# Altium schematic sheet Regulators.SchDoc
size A; SheetNumber: 6; SheetTotal: 6
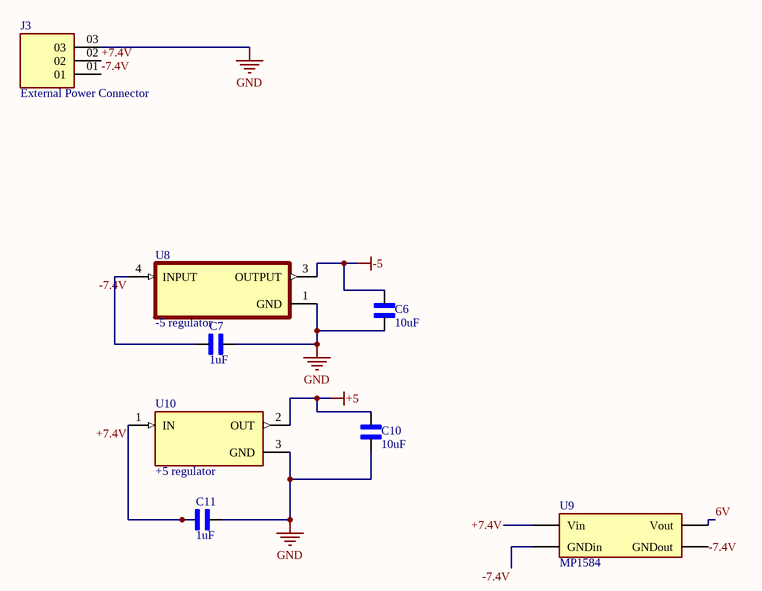
[diagram p0: Regulators.SchDoc]

## Parts
C6  10uF  [CAPC2012X135N]
C7  1uF  [CAPC2012X135N]
C10  10uF  [CAPC2012X135N]
C11  1uF  [CAPC2012X135N]
J3  External Power Connector  [SAMTEC_HTSW-103-XX-X-S]
U8  -5 regulator  [VREG_L7805ACD2T]
U9  MP1584  [MP1584]
U10  +5 regulator  [TO254P1542X460-3N]

## Nets
+5: C10.2 U10.2(OUT)
-5: C6.1 U8.3(OUTPUT)
GND: C6.2 C7.1 C10.1 C11.1 J3.03 U8.1(GND) U10.3(GND)
6V: U9.Vout
+7.4V: C11.2 J3.02 U9.Vin U10.1(IN)
-7.4V: C7.2 J3.01 U8.4(INPUT) U9.GNDin U9.GNDout

## Library data of the parts
C6 C7 C10 C11 = 1uF: SMD Capacitor X7R(EIA) with Capacitance: 1.0uF Tol. 10%. Rated Voltage: 25Vdc; GRM21BR71E105KA99L; MF: Murata; SnapEDA_Link: https://www.snapeda.com/parts/GRM21BR71E105KA99L/Murata/view-part/?ref=snap; Package: 2012 Murata; Value: *; MP: GRM21BR71E105KA99L; Check_prices: https://www.snapeda.com/parts/GRM21BR71E105KA99L/Murata/view-part/?ref=eda
J3 = HTSW-103-XX-X-S: MF: Samtec; Package: None; Price: None; Value: *; MP: HTSW-103-XX-X-S; Availability: Unavailable
U8 = -5 regulator: Linear Voltage Regulator IC Negative Fixed 1 Output 1.5A D2PAK; L7905CD2T-TR; MF: STMicroelectronics; SnapEDA_Link: https://www.snapeda.com/parts/L7905CD2T-TR/STMicroelectronics/view-part/?ref=snap; Package: TO-263-3 STMicroelectronics; Value: *; MP: L7905CD2T-TR; Check_prices: https://www.snapeda.com/parts/L7905CD2T-TR/STMicroelectronics/view-part/?ref=eda
U10 = +5 regulator: Linear Voltage Regulator IC Positive Fixed 1 Output 1.5A D2PAK; L7805CD2T-TR; MF: STMicroelectronics; SnapEDA_Link: https://www.snapeda.com/parts/L7805CD2T-TR/STMicroelectronics/view-part/?ref=snap; Package: TO-263-3 STMicroelectronics; Value: *; MP: L7805CD2T-TR; Check_prices: https://www.snapeda.com/parts/L7805CD2T-TR/STMicroelectronics/view-part/?ref=eda